# Altium schematic sheet pmic_vicor_brick.SchDoc
size A
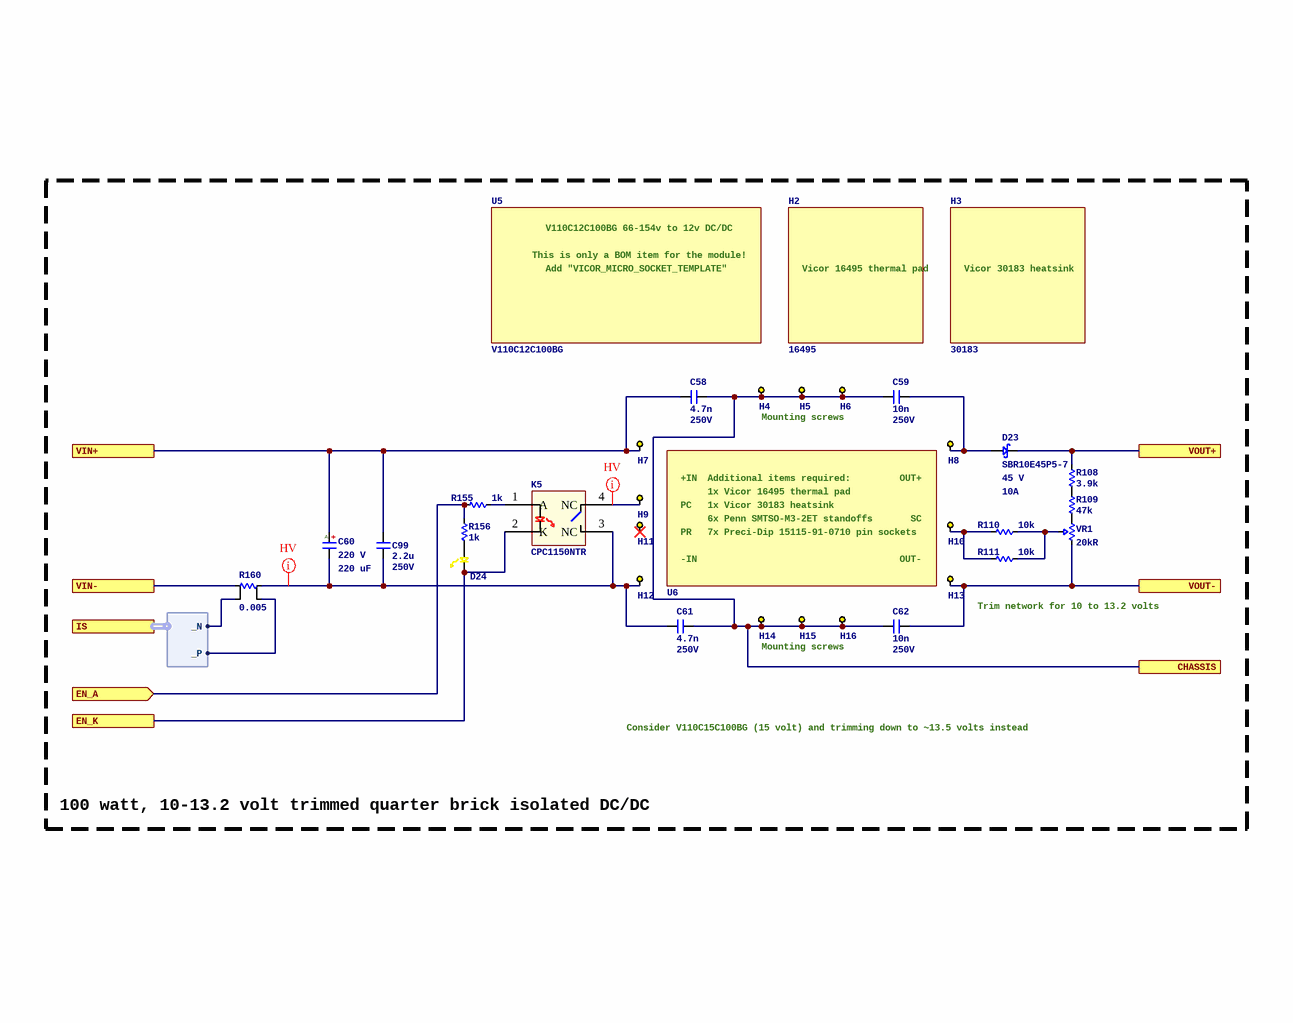
[diagram p0: pmic_vicor_brick.SchDoc]

## Parts
C58  Capacitance: 4.7n  Voltage Rating: 250V  [C0805]  (hidden comment: GCM21B5C2E472JX01L)
C59  Capacitance: 10n  Voltage Rating: 250V  [C0805]  (hidden comment: GRM21B5C2E103JWAAL)
C60  Voltage: 220 V  Capacitance: 220 uF  [CAP_1600X2700X750]  (hidden comment: EKXJ221ELL221MM25S)
C61  Capacitance: 4.7n  Voltage Rating: 250V  [C0805]  (hidden comment: GCM21B5C2E472JX01L)
C62  Capacitance: 10n  Voltage Rating: 250V  [C0805]  (hidden comment: GRM21B5C2E103JWAAL)
C99  Capacitance: 2.2u  Voltage Rating: 250V  [C2220]  (hidden comment: C5750X7T2E225KT000N)
D23  SBR10E45P5-7  Voltage: 45 V  Current: 10A  [POWERDI5]
D24  LTST-C190YKT  [LED_0603P_YELLOW]  (value not drawn)
H2  16495  (mechanical)
H3  30183  [VICOR_HEATSINK_30183]
H4  SMTSO-M3-2ET  [SMTSO-M3-2ET]  (value not drawn)
H5  SMTSO-M3-2ET  [SMTSO-M3-2ET]  (value not drawn)
H6  SMTSO-M3-2ET  [SMTSO-M3-2ET]  (value not drawn)
H7  15115-91-0710  [PRECI-DIP_15115-91-0710]  (value not drawn)
H8  15115-91-0710  [PRECI-DIP_15115-91-0710]  (value not drawn)
H9  15115-91-0710  [PRECI-DIP_15115-91-0710]  (value not drawn)
H10  15115-91-0710  [PRECI-DIP_15115-91-0710]  (value not drawn)
H11  15115-91-0710  [PRECI-DIP_15115-91-0710]  (value not drawn)
H12  15115-91-0710  [PRECI-DIP_15115-91-0710]  (value not drawn)
H13  15115-91-0710  [PRECI-DIP_15115-91-0710]  (value not drawn)
H14  SMTSO-M3-2ET  [SMTSO-M3-2ET]  (value not drawn)
H15  SMTSO-M3-2ET  [SMTSO-M3-2ET]  (value not drawn)
H16  SMTSO-M3-2ET  [SMTSO-M3-2ET]  (value not drawn)
K5  CPC1150NTR  [4SMD300]
R108  value 3.9k  [R0402]  (hidden comment: 0402WGF3901TCE)
R109  value 47k  [R0402]  (hidden comment: 0402WGF4702TCE)
R110  value 10k  [R0402]  (hidden comment: 0402WGF1002TCE)
R111  value 10k  [R0402]  (hidden comment: 0402WGF1002TCE)
R155  value 1k  [R0402]  (hidden comment: 0402WGF1001TCE)
R156  value 1k  [R0402]  (hidden comment: 0402WGF1001TCE)
R160  Resistance (Ohms): 0.005  [VISHAY_WSL2726]  (hidden comment: WSL27265L000FEB)
U5  V110C12C100BG  (mechanical)
U6  CONV_DCDC_VICOR_MICRO_SOCKET_TEMPLATE  [VICOR_MICRO_SOCKET_TEMPLATE]  (value not drawn)  (no BOM)
VR1  value 20kR  [TT_67W]  (hidden comment: 67WR20KLF)

## Ports
CHASSIS, EN_A (in), EN_K, IS (harness DIFF), VIN+, VIN-, VOUT+, VOUT-

## Harnesses
DIFF: _P, _N

## Nets
CHASSIS: C58.2 C59.1 C61.2 C62.1 H4.1 H5.1 H6.1 H14.1 H15.1 H16.1 ; port CHASSIS
EN_A: R155.2 R156.1 ; port EN_A
EN_K: D24.1 K5.2(K) ; port EN_K
VIN+: C58.1 C60.1 C99.1 H7.1 ; port VIN+
VIN-: R160.1 ; port VIN-
VOUT+: D23.2 R108.2 ; port VOUT+
VOUT-: C62.2 H13.1 VR1.3 ; port VOUT-
NetC59_2: C59.2 D23.1 H8.1
NetC60_2: C60.2 C61.1 C99.2 H12.1 K5.3(NC) R160.2
NetD24_2: D24.2 R156.2
NetH9_1: H9.1 K5.4(NC)
NetH10_1: H10.1 R110.1 R111.1
NetK5_1: K5.1(A) R155.1
NetR108_1: R108.1 R109.1
NetR109_2: R109.2 VR1.1
NetR110_2: R110.2 R111.2 VR1.2
NetR160_3: R160.3 ; port IS._N
NetR160_4: R160.4 ; port IS._P

Not connected (* = marked no-connect by the designer): H11 1*

## Layout directives
net class HV: NetC60_2, NetH9_1

## Notes on the sheet
- Mounting screws
- Trim network for 10 to 13.2 volts
- Consider V110C15C100BG (15 volt) and trimming down to ~13.5 volts instead
- 100 watt, 10-13.2 volt trimmed quarter brick isolated DC/DC
- (in symbol AUTO_CAP_ALUM_220UF_220V_EKXJ221ELL221MM25S) A; +
- (in symbol CONV_DCDC_V110C12C100BG_BOM) V110C12C100BG 66-154v to 12v DC/DC; This is only a BOM item for the module!; Add "VICOR_MICRO_SOCKET_TEMPLATE"
- (in symbol CONV_DCDC_VICOR_MICRO_SOCKET_TEMPLATE) +IN; Additional items required:; OUT+; 1x Vicor 16495 thermal pad; PC; 1x Vicor 30183 heatsink; 6x Penn SMTSO-M3-2ET standoffs; SC; PR; 7x Preci-Dip 15115-91-0710 pin sockets; -IN; OUT-
- (in symbol VICOR_HEATSINK_30183) Vicor 30183 heatsink
- (in symbol VICOR_THERMAL_PAD_16495) Vicor 16495 thermal pad

## Library data of the parts
C58 C61 = GCM21B5C2E472JX01L: Manufacturer: Murata Electronics; Dielectric: C0G; Manufacturer Part Number: GCM21B5C2E472JX01L; ComponentLink1URL: https://wmsc.lcsc.com/wmsc/upload/file/pdf/v2/lcsc/1912111437_Murata-Electronics-GCM21B5C2E472JX01L_C415370.pdf; ComponentLink1Description: Datasheet; Package: 0805; Supplier 2: LCSC; Supplier Part Number 2: C415370
C59 C62 = GRM21B5C2E103JWAAL: Manufacturer: Murata Electronics; Dielectric: C0G; Manufacturer Part Number: GRM21B5C2E103JWAAL; ComponentLink1URL: https://wmsc.lcsc.com/wmsc/upload/file/pdf/v2/lcsc/2308111754_Murata-Electronics-GRM21B5C2E103JWAAL_C3870620.pdf; ComponentLink1Description: Datasheet; Package: 0805; Supplier 2: LCSC; Supplier Part Number 2: C3870620
C60 = AUTO_CAP_ALUM_220UF_220V_EKXJ221ELL221MM25S: Aluminum Electrolytic Capacitor, Polarized, Aluminum (wet), 220V, 20% +Tol, 20% -Tol, 220uF, Through Hole Mount; Manufacturer: United Chemi-Con; Manufacturer Part Number: EKXJ221ELL221MM25S; ComponentLink4URL: http://www.chemi-con.co.jp/cgi-bin/CAT_DB/SEARCH/cat_db_al.cgi?e=e&amp;j=p&amp;pdfname=kxj; ComponentLink4Description: Datasheet; Supplier 1: Digikey; Supplier Part Number 1: 565-EKXJ221ELL221MM25S-ND; Supplier 2: LCSC; Supplier Part Number 2: C1600234
C99 = C5750X7T2E225KT000N: Manufacturer: TDK; Dielectric: X7T; ComponentLink1URL: https://wmsc.lcsc.com/wmsc/upload/file/pdf/v2/lcsc/2304140030_TDK-C5750X7T2E225KT000N_C435266.pdf; ComponentLink1Description: Datasheet; Manufacturer Part Number: C5750X7T2E225KT000N; Package: 2220; Supplier 2: LCSC; Supplier Part Number 2: C435266
D23 = SCHOTTKY_45V_SBR10E45P5-7: Rectifier Diode, 1 Phase, 1 Element, 10A, 45V V(RRM), Silicon; Manufacturer: Diodes; Supplier 1: Digikey; Supplier Part Number 1: SBR10E45P5-7DICT-ND; Manufacturer Part Number: SBR10E45P5-7; ComponentLink1Description: Datasheet; ComponentLink1URL: https://www.diodes.com/assets/Datasheets/SBR10E45P5.pdf; Supplier 2: LCSC; Supplier Part Number 2: C73569
D24 = LED_0603_YELLOW_LTST-C190YKT: LED YELLOW CLEAR 0603 SMD; Manufacturer: Lite-On Inc; Supplier 1: Digikey; ComponentLink1URL: https://mm.digikey.com/Volume0/opasdata/d220001/medias/docus/1176/LTST-C190YKT.pdf; ComponentLink1Description: Datasheet; Supplier Part Number 1: 160-1184-1-ND; Manufacturer Part Number: LTST-C190YKT; Supplier 2: LCSC; Supplier Part Number 2: C125097
H2 = VICOR_THERMAL_PAD_16495: Heat Sink, Aluminum; Manufacturer: Vicor; Supplier 1: Digikey; Supplier Part Number 1: 1102-1560-ND; Manufacturer Part Number: 16495; ComponentLink1Description: Drawing; ComponentLink1URL: https://asp.vicorpower.com/CADPDF/Q6T45D.PDF; Supplier 2: Mouser; Supplier Part Number 2: 492-16495
H3 = VICOR_HEATSINK_30183: Heat Sink, Aluminum; Manufacturer: Vicor; Supplier 1: Digikey; Supplier Part Number 1: 1102-1595-ND; Manufacturer Part Number: 30183; ComponentLink1Description: Drawing; ComponentLink1URL: https://asp.vicorpower.com/CADPDF/Q6T45D.PDF; Supplier 2: Mouser; Supplier Part Number 2: 492-30183
H4-H6 H14-H16 = STANDOFF_SMTSO-M3-2ET: Standoff Round Swage F/F M3 X 0.5-THD Carbon Steel Electro-Tin ASTM B545; Manufacturer: PennEngineering; Supplier 1: Mouser; Supplier Part Number 1: 153-SMTSO-M3-2ET; Manufacturer Part Number: SMTSO-M3-2ET; Supplier 2: LCSC; Supplier Part Number 2: C18212183
H7-H13 = PIN_SOCKET_15115-91-0710: Pin Receptacle Connector 0.078" ~ 0.096" (1.98mm ~ 2.44mm) No Tail Solder; Manufacturer: Preci-Dip; Supplier 1: Digikey; Supplier Part Number 1: 1212-15115-91-0710-ND; Manufacturer Part Number: 15115-91-0710; Supplier 2: LCSC; Supplier Part Number 2: C20239898
K5 = SSR_350V_CPC1150NTR: CPC1150N Series SPST 120 mA 350 V Single Channel Solid State Relay SMT - SOIC-4; Manufacturer: Littelfuse; Supplier 1: Digikey; Supplier Part Number 1: 5656-CPC1150NTRCT-ND; Manufacturer Part Number: CPC1150NTR; ComponentLink1URL: https://www.littelfuse.com/media?resourcetype=datasheets&itemid=7f3e9a05-5c4a-493e-bfe5-2075df32c7f9&filename=littelfuse-integrated-circuits-cpc1150n-series-datasheet; ComponentLink1Description: Datasheet; Supplier 2: LCSC; Supplier Part Number 2: C5299824
R108 = 0402WGF3901TCE: Manufacturer: UNI-ROYAL(Uniroyal Elec); Tolerance: 1%; Temperature Coefficient: Â±100ppm/â„ƒ; Power Rating (mW): 62.5; Manufacturer Part Number: 0402WGF3901TCE; ComponentLink1Description: Datasheet; ComponentLink1URL: https://wmsc.lcsc.com/wmsc/upload/file/pdf/v2/lcsc/2206010000_UNI-ROYAL-Uniroyal-Elec-0402WGF3901TCE_C51721.pdf; Package: 0402; Supplier 2: LCSC; Supplier Part Number 2: C51721
R109 = 0402WGF4702TCE: Manufacturer: UNI-ROYAL(Uniroyal Elec); Tolerance: 1%; Temperature Coefficient: Â±100ppm/â„ƒ; Power Rating (mW): 62.5; Manufacturer Part Number: 0402WGF4702TCE; ComponentLink1Description: Datasheet; ComponentLink1URL: https://wmsc.lcsc.com/wmsc/upload/file/pdf/v2/lcsc/2206010100_UNI-ROYAL-Uniroyal-Elec-0402WGF4702TCE_C25792.pdf; Package: 0402; Supplier 2: LCSC; Supplier Part Number 2: C25792
R110 R111 = 0402WGF1002TCE: Manufacturer: UNI-ROYAL(Uniroyal Elec); Tolerance: 1%; Temperature Coefficient: Â±100ppm/â„ƒ; Power Rating (mW): 62.5; Manufacturer Part Number: 0402WGF1002TCE; ComponentLink1Description: Datasheet; ComponentLink1URL: https://wmsc.lcsc.com/wmsc/upload/file/pdf/v2/lcsc/2206010100_UNI-ROYAL-Uniroyal-Elec-0402WGF1002TCE_C25744.pdf; Package: 0402; Supplier 2: LCSC; Supplier Part Number 2: C25744
R155 R156 = 0402WGF1001TCE: Manufacturer: UNI-ROYAL(Uniroyal Elec); Tolerance: 1%; Temperature Coefficient: Â±100ppm/â„ƒ; Power Rating (mW): 62.5; ComponentLink1Description: Datasheet; ComponentLink1URL: https://wmsc.lcsc.com/wmsc/upload/file/pdf/v2/lcsc/2206010216_UNI-ROYAL-Uniroyal-Elec-0402WGF1001TCE_C11702.pdf; Manufacturer Part Number: 0402WGF1001TCE; Package: 0402; Supplier 2: LCSC; Supplier Part Number 2: C11702
R160 = RES_CURRENT_SENSE_0.005_OHM_1%_3W_2726_WSL27265L000FEB: RES SMD 0.005 OHM 1% 3W 2726; Manufacturer: Vishay Dale; Supplier 1: Digikey; Manufacturer Part Number: WSL27265L000FEB; ComponentLink1URL: http://www.vishay.com/docs/30131/wsl2726.pdf; ComponentLink1Description: Datasheet; Supplier Part Number 1: WSLQ-.005CT-ND; Supplier 2: LCSC; Supplier Part Number 2: C1517421
U5 = CONV_DCDC_V110C12C100BG_BOM: APSM DCDC, 1 Output, 100W, Hybrid; Manufacturer: Vicor; Supplier 1: Digikey; Supplier Part Number 1: V110C12C100BG-ND; Manufacturer Part Number: V110C12C100BG; ComponentLink2URL: https://www.vicorpower.com/documents/datasheets/ds_110vin-micro-family.pdf; ComponentLink2Description: Datasheet; ComponentLink3Description: Application guide; ComponentLink3URL: https://www.vicorpower.com/documents/applications_manual/fas_trak_apps_manual.pdf
U6 = CONV_DCDC_VICOR_MICRO_SOCKET_TEMPLATE: This is a template for the placement of socket pins and heatsink for a Vicor micro brick
VR1 = POT_67WR20KLF: Trimmer, Cermet, 0.5W, 20000ohm, 200V, 10% +/-Tol, 100ppm/Cel, 20 Turn(s); Manufacturer: TT BI; Supplier 1: Digikey; Supplier Part Number 1: 987-1090-ND; Manufacturer Part Number: 67WR20KLF; ComponentLink1Description: Datasheet; ComponentLink1URL: https://www.ttelectronics.com/TTElectronics/media/ProductFiles/Datasheet/67.pdf; Supplier 2: LCSC; Supplier Part Number 2: C6826039